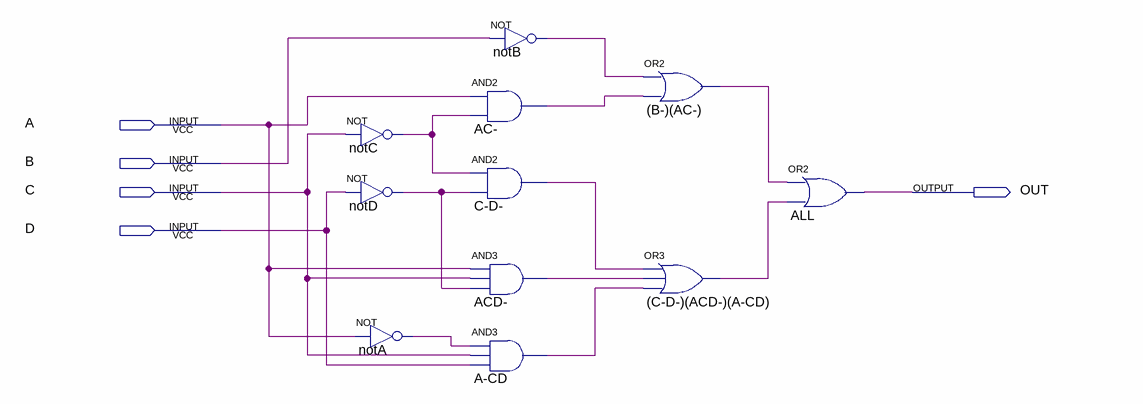
[diagram p0: schematic sheet]
// Quartus schematic b.bdf as structural Verilog: 11 symbols, 5 pins
module b (
  input  A,
  input  B,
  input  C,
  input  D,
  output OUT
);

  wire _B___AC___out, _C_D___ACD___A_CD__out, A_CD_out, AC__out, ACD__out, C_D__out, notA_out, notB_out,
       notC_out, notD_out;

  not notC (notC_out, C);
  not notD (notD_out, D);
  not notA (notA_out, A);
  not notB (notB_out, B);
  and \AC-  (AC__out, A, notC_out);
  and \C-D-  (C_D__out, notC_out, notD_out);
  and \ACD-  (ACD__out, A, C, notD_out);
  and \A-CD  (A_CD_out, notA_out, C, D);
  or \u_(B-)(AC-)  (_B___AC___out, notB_out, AC__out);
  or \u_(C-D-)(ACD-)(A-CD)  (_C_D___ACD___A_CD__out, C_D__out, ACD__out, A_CD_out);
  or ALL (OUT, _B___AC___out, _C_D___ACD___A_CD__out);
endmodule
